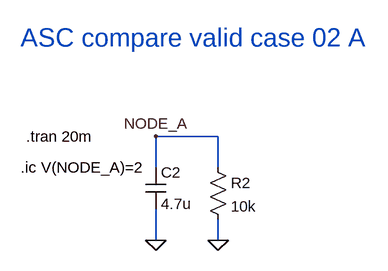
[diagram p0: schematic valid_case_02_a.asc]
valid_case_02_a.asc, the LTspice schematic file:
Version 4.1
SHEET 1 880 680
WIRE 208 64 112 64
WIRE 112 112 112 64
WIRE 208 112 208 64
WIRE 112 224 112 176
WIRE 208 224 208 192
FLAG 208 224 0
FLAG 112 224 0
FLAG 112 64 NODE_A
SYMBOL cap 96 112 R0
SYMATTR InstName C2
SYMATTR Value 4.7u
SYMBOL res 192 96 R0
SYMATTR InstName R2
SYMATTR Value 10k
TEXT -96 112 Left 2 !.ic V(NODE_A)=2
TEXT -88 64 Left 2 !.tran 20m
TEXT -96 -88 Left 4 ;ASC compare valid case 02 A

The netlist it stands for:
* valid_case_02_a.asc
C2 NODE_A 0 4.7u
R2 NODE_A 0 10k
.ic V(NODE_A)=2
.tran 20m
* ASC compare valid case 02 A
.backanno
.end